# Altium schematic sheet MK32.SchDoc: Модуль МК32
size 420 x 297 mm; ApprovedBy: Чубунов; CheckedBy: Базь; Author: Зазнов; DocumentNumber: Э.5161.01.00.00Э3; SheetNumber: 1; SheetTotal: 3; NormInspection: Гавазюк; ProcessInspection: Александров; Title2str: (ММК32); DocumentType: Схема электрическая принципиальная; FirstReferrence: Э.5161.01.00.00
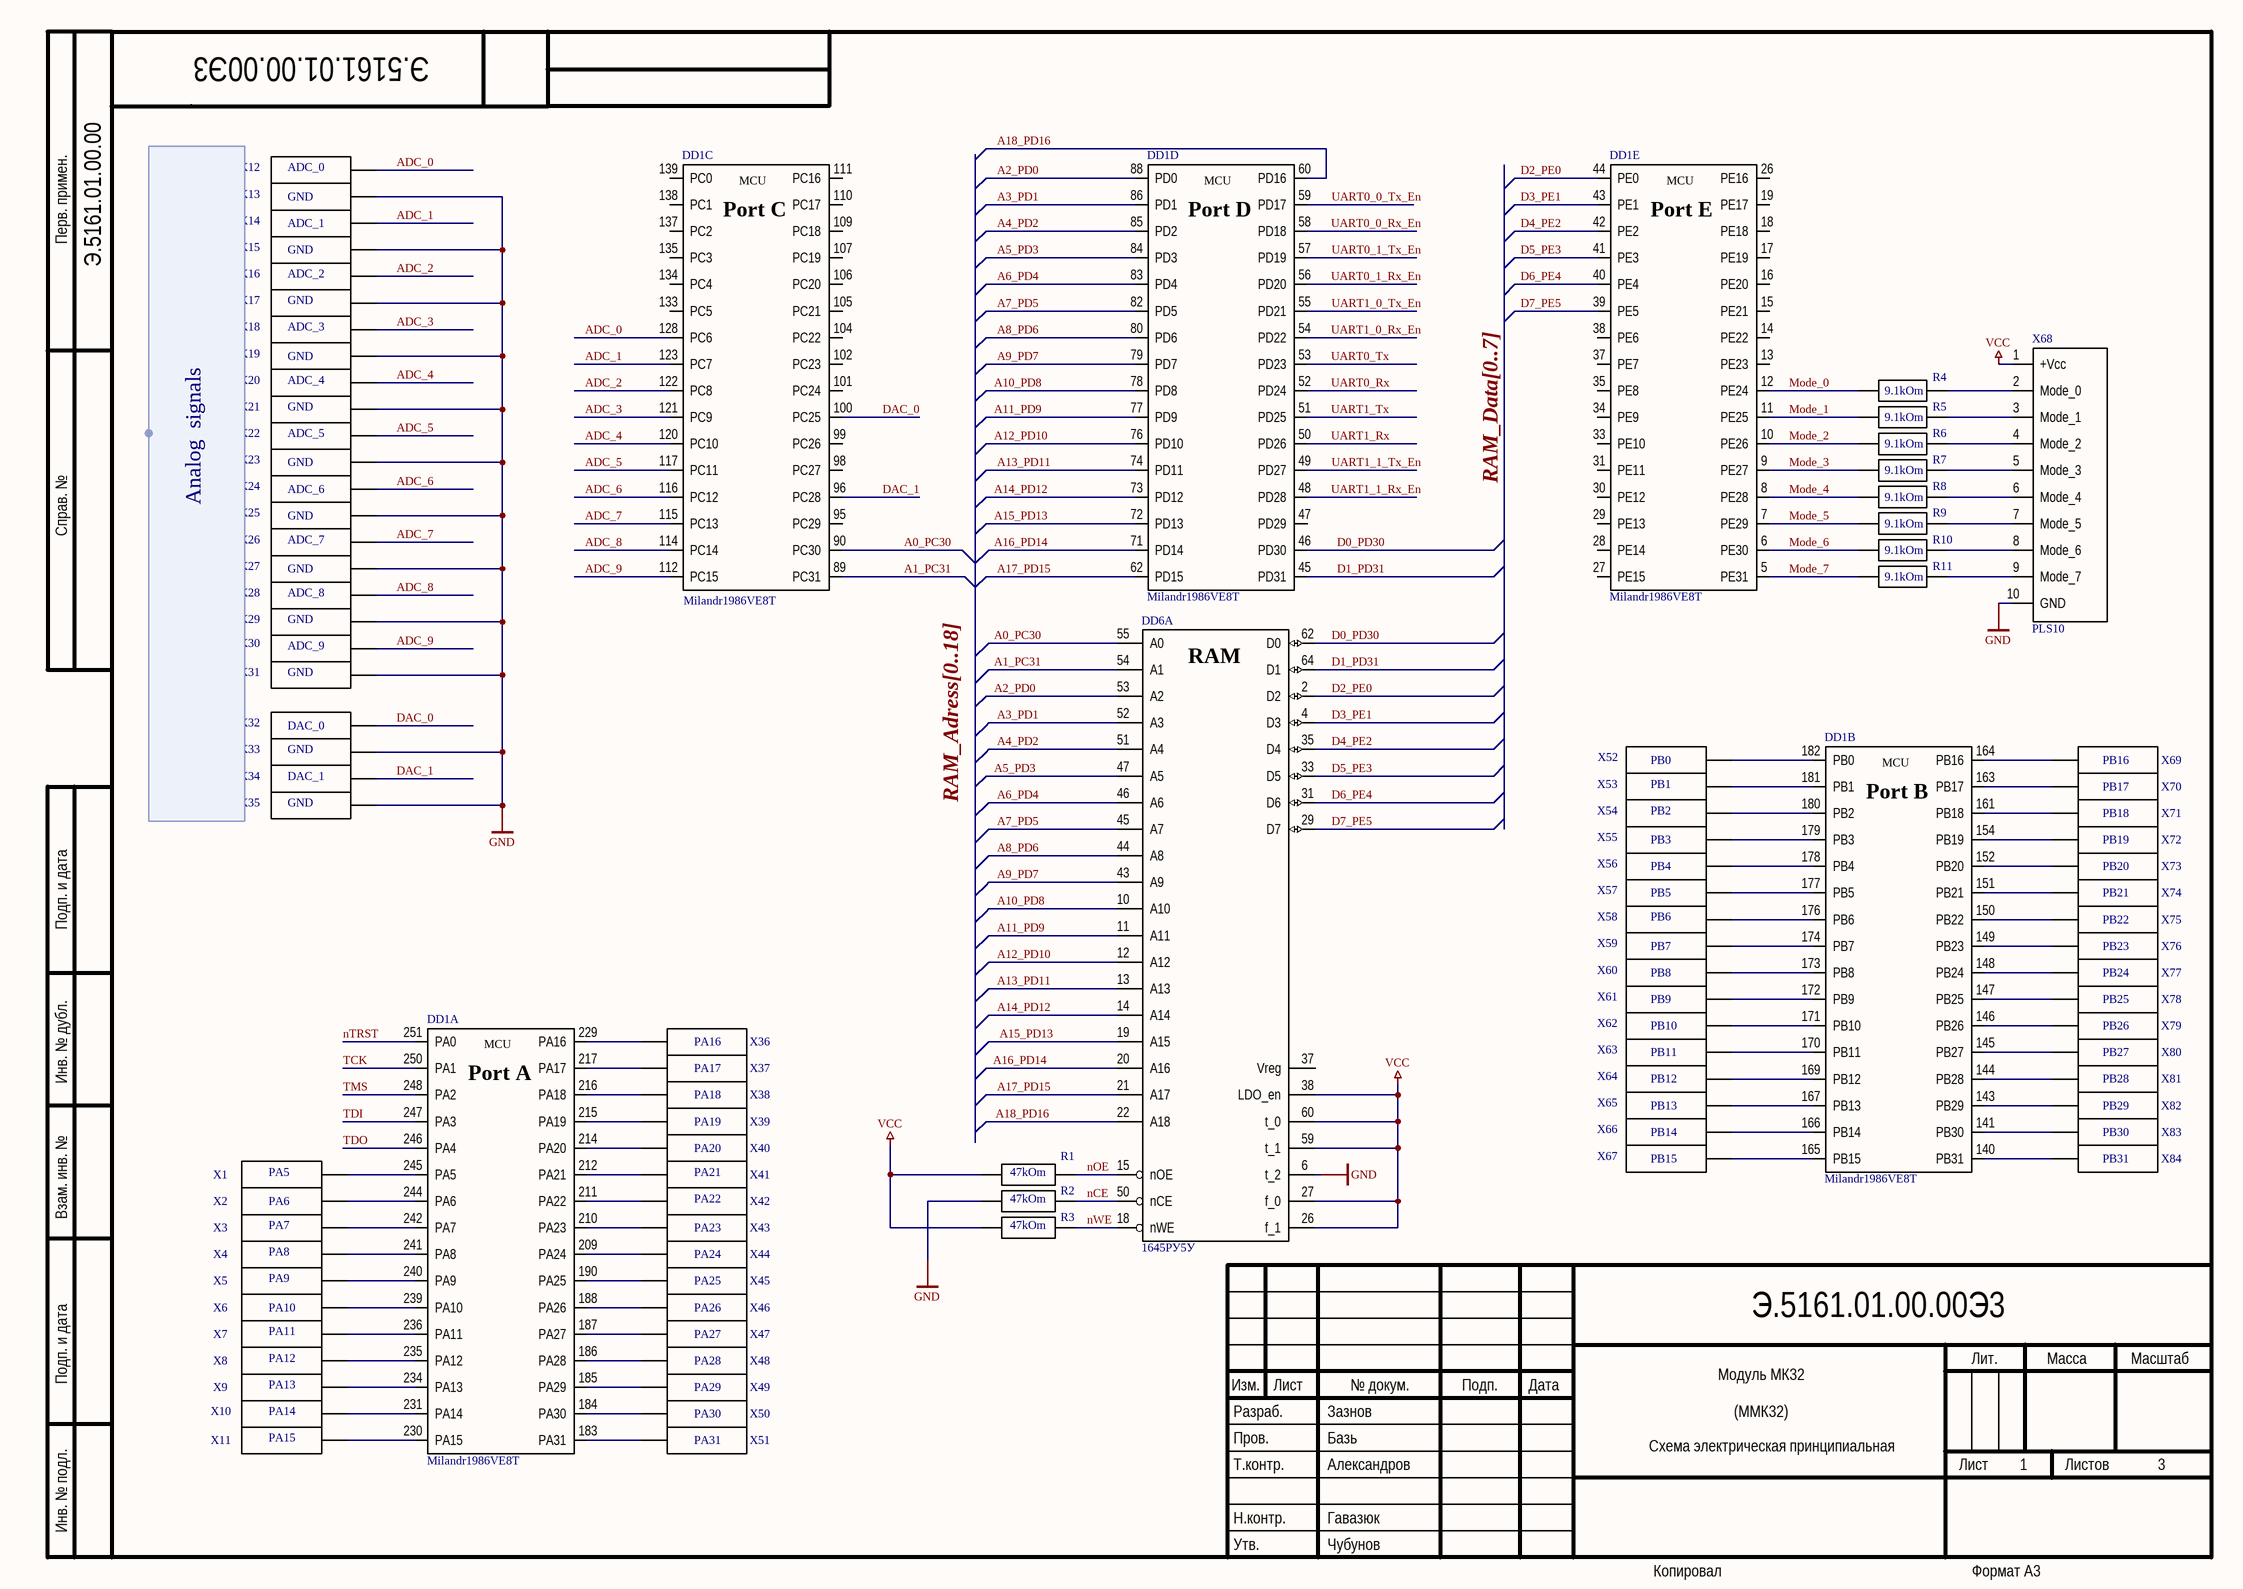
[diagram p0: MK32.SchDoc]

## Parts
DD1  Milandr1986VE8T  [4244.256-3]  (parts A,B,C,D,E of 6)
DD6  1645РУ5У  [5134.64-6]  (part A of 2)
R1  47kOm  [C 0603]
R2  47kOm  [C 0603]
R3  47kOm  [C 0603]
R4  9.1kOm  [C 0603]
R5  9.1kOm  [C 0603]
R6  9.1kOm  [C 0603]
R7  9.1kOm  [C 0603]
R8  9.1kOm  [C 0603]
R9  9.1kOm  [C 0603]
R10  9.1kOm  [C 0603]
R11  9.1kOm  [C 0603]
X1  PA5  [PL]
X2  PA6  [PL]
X3  PA7  [PL]
X4  PA8  [PL]
X5  PA9  [PL]
X6  PA10  [PL]
X7  PA11  [PL]
X8  PA12  [PL]
X9  PA13  [PL]
X10  PA14  [PL]
X11  PA15  [PL]
X12  ADC_0  [PL]
X13  GND  [PL]
X14  ADC_1  [PL]
X15  GND  [PL]
X16  ADC_2  [PL]
X17  GND  [PL]
X18  ADC_3  [PL]
X19  GND  [PL]
X20  ADC_4  [PL]
X21  GND  [PL]
X22  ADC_5  [PL]
X23  GND  [PL]
X24  ADC_6  [PL]
X25  GND  [PL]
X26  ADC_7  [PL]
X27  GND  [PL]
X28  ADC_8  [PL]
X29  GND  [PL]
X30  ADC_9  [PL]
X31  GND  [PL]
X32  DAC_0  [PL]
X33  GND  [PL]
X34  DAC_1  [PL]
X35  GND  [PL]
X36  PA16  [PL]
X37  PA17  [PL]
X38  PA18  [PL]
X39  PA19  [PL]
X40  PA20  [PL]
X41  PA21  [PL]
X42  PA22  [PL]
X43  PA23  [PL]
X44  PA24  [PL]
X45  PA25  [PL]
X46  PA26  [PL]
X47  PA27  [PL]
X48  PA28  [PL]
X49  PA29  [PL]
X50  PA30  [PL]
X51  PA31  [PL]
X52  PB0  [PL]
X53  PB1  [PL]
X54  PB2  [PL]
X55  PB3  [PL]
X56  PB4  [PL]
X57  PB5  [PL]
X58  PB6  [PL]
X59  PB7  [PL]
X60  PB8  [PL]
X61  PB9  [PL]
X62  PB10  [PL]
X63  PB11  [PL]
X64  PB12  [PL]
X65  PB13  [PL]
X66  PB14  [PL]
X67  PB15  [PL]
X68  PLS10  [PLS10]
X69  PB16  [PL]
X70  PB17  [PL]
X71  PB18  [PL]
X72  PB19  [PL]
X73  PB20  [PL]
X74  PB21  [PL]
X75  PB22  [PL]
X76  PB23  [PL]
X77  PB24  [PL]
X78  PB25  [PL]
X79  PB26  [PL]
X80  PB27  [PL]
X81  PB28  [PL]
X82  PB29  [PL]
X83  PB30  [PL]
X84  PB31  [PL]

## Harnesses
Analog  signals: 

## Nets
GND: DD6.6(t_2) R2.2 X13.?1(name) X15.?1(name) X17.?1(name) X19.?1(name) X21.?1(name) X23.?1(name) X25.?1(name) X27.?1(name) X29.?1(name) X31.?1(name) X33.?1(name) X35.?1(name) X68.10(GND)
VCC: DD6.26(f_1) DD6.27(f_0) DD6.38(LDO_en) DD6.59(t_1) DD6.60(t_0) R1.2 R3.2 X68.1(+Vcc)
A0_PC30: DD1.90(PC30) DD6.55(A0)
A1_PC31: DD1.89(PC31) DD6.54(A1)
A2_PD0: DD1.88(PD0) DD6.53(A2)
A3_PD1: DD1.86(PD1) DD6.52(A3)
A4_PD2: DD1.85(PD2) DD6.51(A4)
A5_PD3: DD1.84(PD3) DD6.47(A5)
A6_PD4: DD1.83(PD4) DD6.46(A6)
A7_PD5: DD1.82(PD5) DD6.45(A7)
A8_PD6: DD1.80(PD6) DD6.44(A8)
A9_PD7: DD1.79(PD7) DD6.43(A9)
A10_PD8: DD1.78(PD8) DD6.10(A10)
A11_PD9: DD1.77(PD9) DD6.11(A11)
A12_PD10: DD1.76(PD10) DD6.12(A12)
A13_PD11: DD1.74(PD11) DD6.13(A13)
A14_PD12: DD1.73(PD12) DD6.14(A14)
A15_PD13: DD1.72(PD13) DD6.19(A15)
A16_PD14: DD1.71(PD14) DD6.20(A16)
A17_PD15: DD1.62(PD15) DD6.21(A17)
A18_PD16: DD1.60(PD16) DD6.22(A18)
ADC_0: DD1.128(PC6) X12.?1(name)
ADC_1: DD1.123(PC7) X14.?1(name)
ADC_2: DD1.122(PC8) X16.?1(name)
ADC_3: DD1.121(PC9) X18.?1(name)
ADC_4: DD1.120(PC10) X20.?1(name)
ADC_5: DD1.117(PC11) X22.?1(name)
ADC_6: DD1.116(PC12) X24.?1(name)
ADC_7: DD1.115(PC13) X26.?1(name)
ADC_8: DD1.114(PC14) X28.?1(name)
ADC_9: DD1.112(PC15) X30.?1(name)
D0_PD30: DD1.46(PD30) DD6.62(D0)
D1_PD31: DD1.45(PD31) DD6.64(D1)
D2_PE0: DD1.44(PE0) DD6.2(D2)
D3_PE1: DD1.43(PE1) DD6.4(D3)
D4_PE2: DD1.42(PE2) DD6.35(D4)
D5_PE3: DD1.41(PE3) DD6.33(D5)
D6_PE4: DD1.40(PE4) DD6.31(D6)
D7_PE5: DD1.39(PE5) DD6.29(D7)
DAC_0: DD1.100(PC25) X32.?1(name)
DAC_1: DD1.96(PC28) X34.?1(name)
Mode_0: DD1.12(PE24) R4.1
Mode_1: DD1.11(PE25) R5.1
Mode_2: DD1.10(PE26) R6.1
Mode_3: DD1.9(PE27) R7.1
Mode_4: DD1.8(PE28) R8.1
Mode_5: DD1.7(PE29) R9.1
Mode_6: DD1.6(PE30) R10.1
Mode_7: DD1.5(PE31) R11.1
nCE: DD6.50(nCE) R2.1
nOE: DD6.15(nOE) R1.1
nTRST: DD1.251(PA0)
nWE: DD6.18(nWE) R3.1
TCK: DD1.250(PA1)
TDI: DD1.247(PA3)
TDO: DD1.246(PA4)
TMS: DD1.248(PA2)
UART0_0_Rx_En: DD1.58(PD18)
UART0_0_Tx_En: DD1.59(PD17)
UART0_1_Rx_En: DD1.56(PD20)
UART0_1_Tx_En: DD1.57(PD19)
UART0_Rx: DD1.52(PD24)
UART0_Tx: DD1.53(PD23)
UART1_0_Rx_En: DD1.54(PD22)
UART1_0_Tx_En: DD1.55(PD21)
UART1_1_Rx_En: DD1.48(PD28)
UART1_1_Tx_En: DD1.49(PD27)
UART1_Rx: DD1.50(PD26)
UART1_Tx: DD1.51(PD25)
NetDD1_140: DD1.140(PB31) X84.?1(name)
NetDD1_141: DD1.141(PB30) X83.?1(name)
NetDD1_143: DD1.143(PB29) X82.?1(name)
NetDD1_144: DD1.144(PB28) X81.?1(name)
NetDD1_145: DD1.145(PB27) X80.?1(name)
NetDD1_146: DD1.146(PB26) X79.?1(name)
NetDD1_147: DD1.147(PB25) X78.?1(name)
NetDD1_148: DD1.148(PB24) X77.?1(name)
NetDD1_149: DD1.149(PB23) X76.?1(name)
NetDD1_150: DD1.150(PB22) X75.?1(name)
NetDD1_151: DD1.151(PB21) X74.?1(name)
NetDD1_152: DD1.152(PB20) X73.?1(name)
NetDD1_154: DD1.154(PB19) X72.?1(name)
NetDD1_161: DD1.161(PB18) X71.?1(name)
NetDD1_163: DD1.163(PB17) X70.?1(name)
NetDD1_164: DD1.164(PB16) X69.?1(name)
NetDD1_165: DD1.165(PB15) X67.?1(name)
NetDD1_166: DD1.166(PB14) X66.?1(name)
NetDD1_167: DD1.167(PB13) X65.?1(name)
NetDD1_169: DD1.169(PB12) X64.?1(name)
NetDD1_170: DD1.170(PB11) X63.?1(name)
NetDD1_171: DD1.171(PB10) X62.?1(name)
NetDD1_172: DD1.172(PB9) X61.?1(name)
NetDD1_173: DD1.173(PB8) X60.?1(name)
NetDD1_174: DD1.174(PB7) X59.?1(name)
NetDD1_176: DD1.176(PB6) X58.?1(name)
NetDD1_177: DD1.177(PB5) X57.?1(name)
NetDD1_178: DD1.178(PB4) X56.?1(name)
NetDD1_179: DD1.179(PB3) X55.?1(name)
NetDD1_180: DD1.180(PB2) X54.?1(name)
NetDD1_181: DD1.181(PB1) X53.?1(name)
NetDD1_182: DD1.182(PB0) X52.?1(name)
NetDD1_183: DD1.183(PA31) X51.?1(name)
NetDD1_184: DD1.184(PA30) X50.?1(name)
NetDD1_185: DD1.185(PA29) X49.?1(name)
NetDD1_186: DD1.186(PA28) X48.?1(name)
NetDD1_187: DD1.187(PA27) X47.?1(name)
NetDD1_188: DD1.188(PA26) X46.?1(name)
NetDD1_190: DD1.190(PA25) X45.?1(name)
NetDD1_209: DD1.209(PA24) X44.?1(name)
NetDD1_210: DD1.210(PA23) X43.?1(name)
NetDD1_211: DD1.211(PA22) X42.?1(name)
NetDD1_212: DD1.212(PA21) X41.?1(name)
NetDD1_214: DD1.214(PA20) X40.?1(name)
NetDD1_215: DD1.215(PA19) X39.?1(name)
NetDD1_216: DD1.216(PA18) X38.?1(name)
NetDD1_217: DD1.217(PA17) X37.?1(name)
NetDD1_229: DD1.229(PA16) X36.?1(name)
NetDD1_230: DD1.230(PA15) X11.?1(name)
NetDD1_231: DD1.231(PA14) X10.?1(name)
NetDD1_234: DD1.234(PA13) X9.?1(name)
NetDD1_235: DD1.235(PA12) X8.?1(name)
NetDD1_236: DD1.236(PA11) X7.?1(name)
NetDD1_239: DD1.239(PA10) X6.?1(name)
NetDD1_240: DD1.240(PA9) X5.?1(name)
NetDD1_241: DD1.241(PA8) X4.?1(name)
NetDD1_242: DD1.242(PA7) X3.?1(name)
NetDD1_244: DD1.244(PA6) X2.?1(name)
NetDD1_245: DD1.245(PA5) X1.?1(name)
NetR4_2: R4.2 X68.2(Mode_0)
NetR5_2: R5.2 X68.3(Mode_1)
NetR6_2: R6.2 X68.4(Mode_2)
NetR7_2: R7.2 X68.5(Mode_3)
NetR8_2: R8.2 X68.6(Mode_4)
NetR9_2: R9.2 X68.7(Mode_5)
NetR10_2: R10.2 X68.8(Mode_6)
NetR11_2: R11.2 X68.9(Mode_7)

Not connected (* = marked no-connect by the designer): DD1 13(PE23) 14(PE22) 15(PE21) 16(PE20) 17(PE19) 18(PE18) 19(PE17) 26(PE16) 27(PE15) 28(PE14) 29(PE13) 30(PE12) 31(PE11) 33(PE10) 34(PE9) 35(PE8) 37(PE7) 38(PE6) 47(PD29) 95(PC29) 98(PC27) 99(PC26) 101(PC24) 102(PC23) 104(PC22) 105(PC21) 106(PC20) 107(PC19) 109(PC18) 110(PC17) 111(PC16) 133(PC5) 134(PC4) 135(PC3) 137(PC2) 138(PC1) 139(PC0); DD6 37(Vreg)

## Buses and harness runs
bus RAM_Adress[0..18]
bus RAM_Data[0..7]

## Notes on the sheet
- Labels drawn without touching a wire or pin: RAM_Adress[0..18]
- Перв. примен.
- Справ. №
- Подп. и дата
- Инв. № дубл.
- Взам. инв. №
- Разраб.
- Изм.
- Лист
- № докум.
- Подп.
- Дата
- Лит.
- Масса
- Масштаб
- Пров.
- Т.контр.
- Листов
- Инв. № подл.
- Утв.
- Н.контр.
- Копировал
- Формат А3
- (in symbol 1645РУ5У, part A) RAM
- (in symbol Milandr1986VE8T, part A) MCU; Port A
- (in symbol Milandr1986VE8T, part B) MCU; Port B
- (in symbol Milandr1986VE8T, part C) MCU; Port C
- (in symbol Milandr1986VE8T, part D) MCU; Port D
- (in symbol Milandr1986VE8T, part E) MCU; Port E

## Library data of the parts
R1-R11 = R0603
X1-X67 X69-X84 = PL
DD1 = Milandr1986VE8T: Parameter 1: *